# EAGLE design oled_array_v1 (EAGLE 7.6.0)
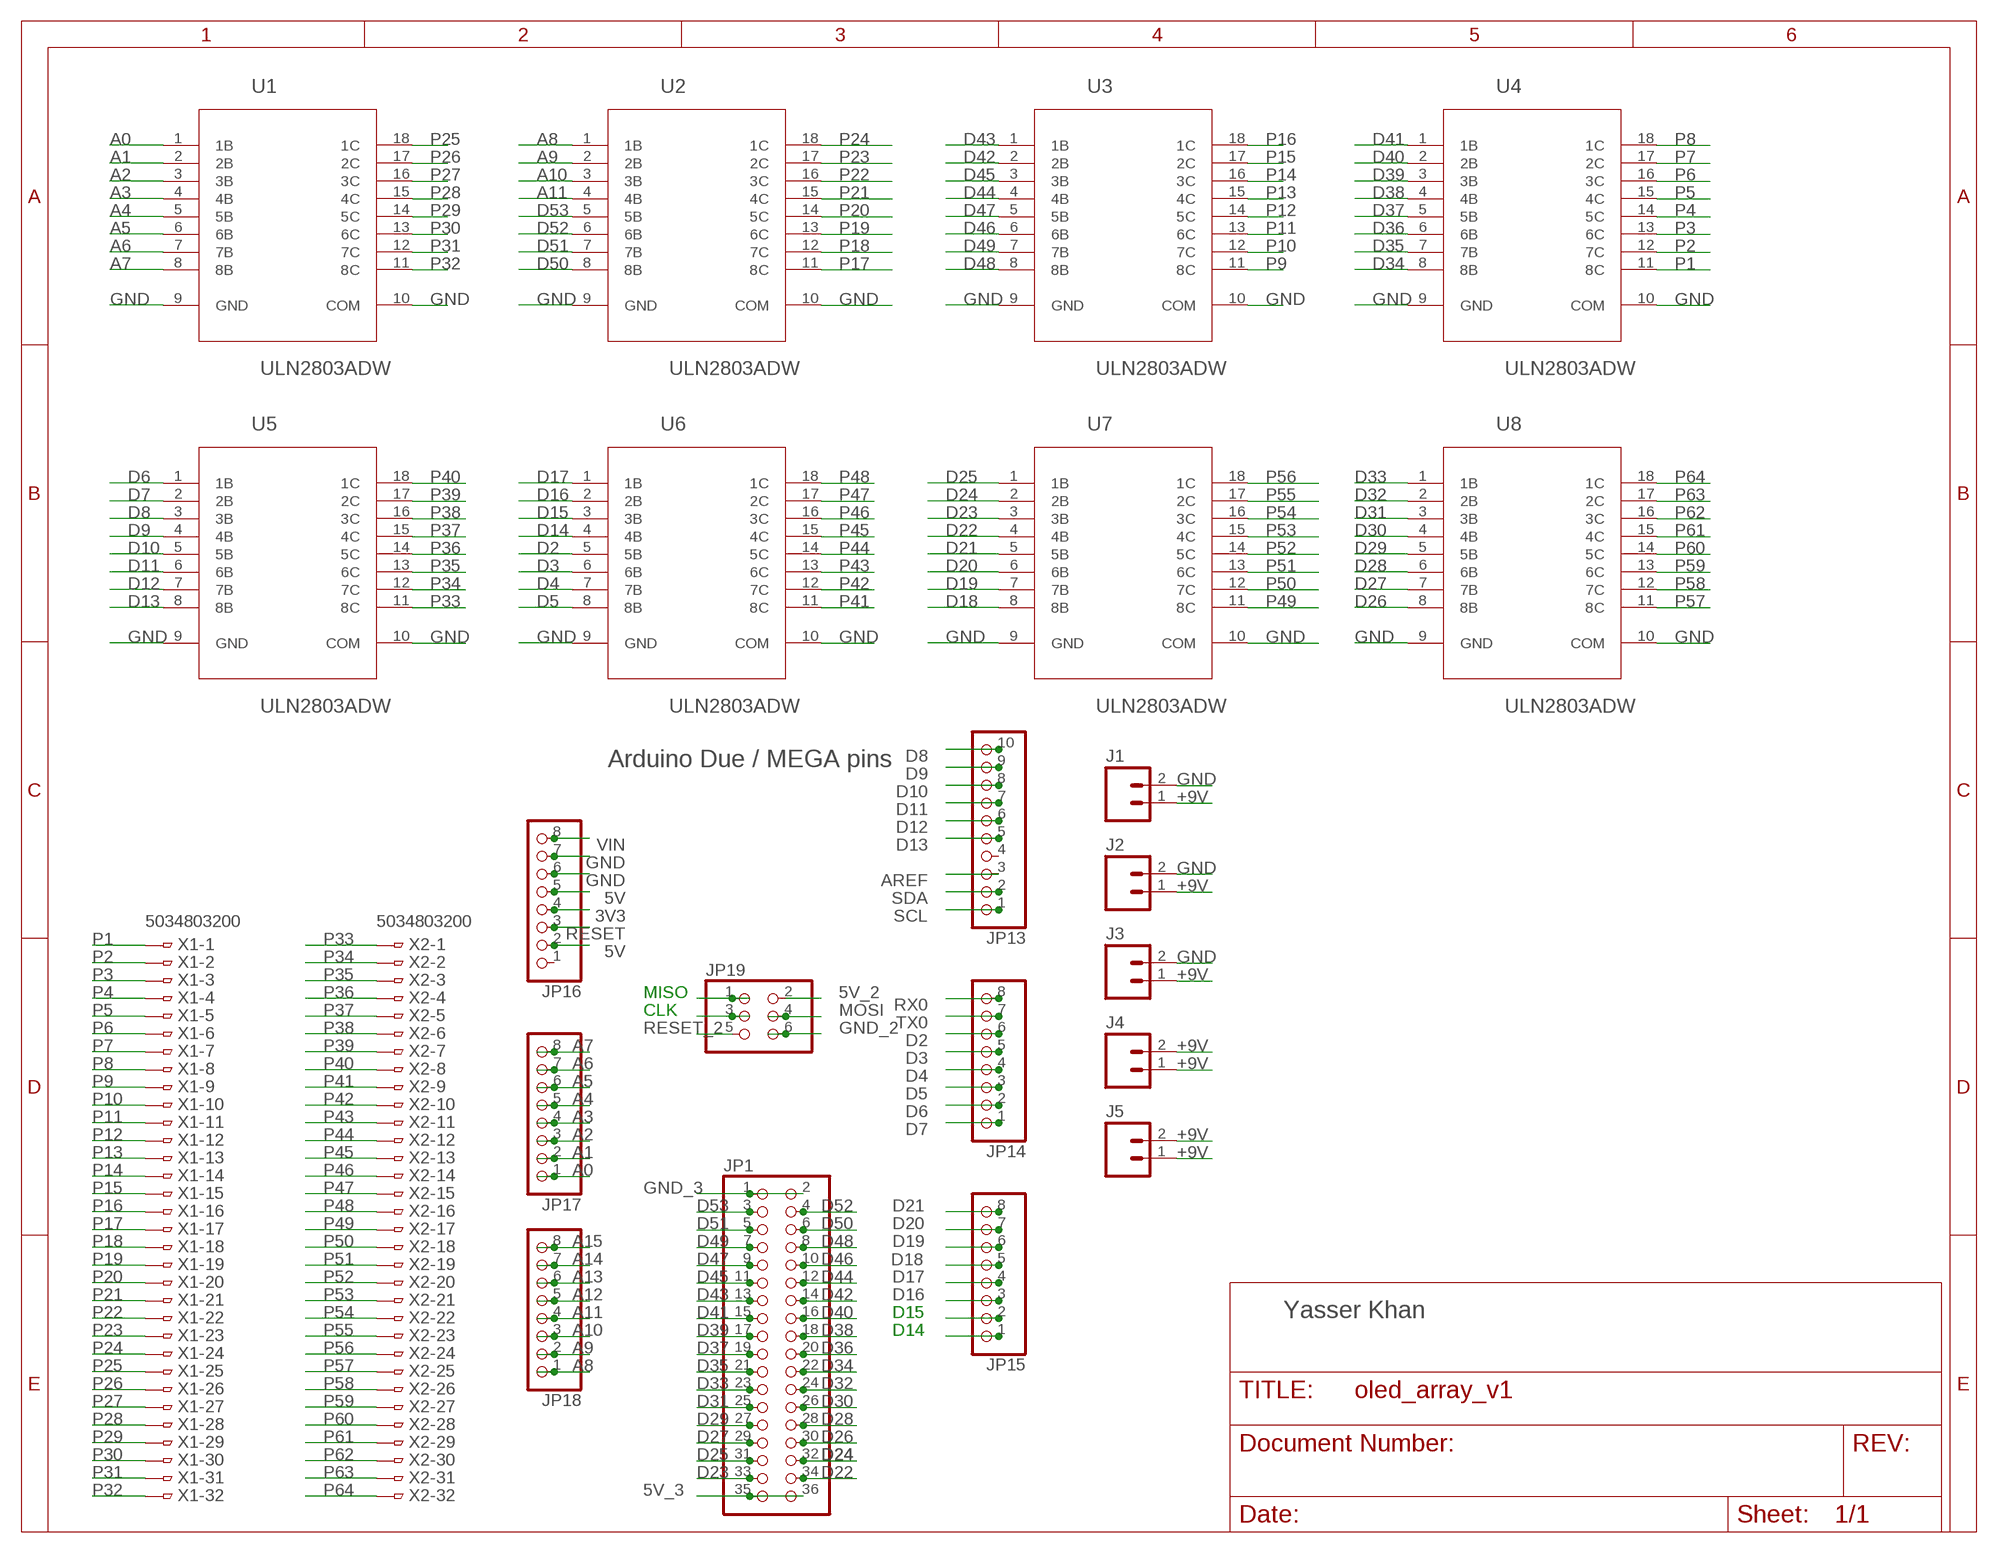
[diagram p0: schematic, sheet 1]

## Parts
J1  M02PTH  [1X02]
J2  M02PTH  [1X02]
J3  M02PTH  [1X02]
J4  M02PTH  [1X02]
J5  M02PTH  [1X02]
JP1  PINHD-2X18  [2X18]
JP13  PINHD-1X10  [1X10]
JP14  PINHD-1X8  [1X08]
JP15  PINHD-1X8  [1X08]
JP16  PINHD-1X8  [1X08]
JP17  PINHD-1X8  [1X08]
JP18  PINHD-1X8  [1X08]
JP19  PINHD-2X3  [2X03]
U1  ULN2803ADW  [SOIC127P1030X265-18N]
U2  ULN2803ADW  [SOIC127P1030X265-18N]
U3  ULN2803ADW  [SOIC127P1030X265-18N]
U4  ULN2803ADW  [SOIC127P1030X265-18N]
U5  ULN2803ADW  [SOIC127P1030X265-18N]
U6  ULN2803ADW  [SOIC127P1030X265-18N]
U7  ULN2803ADW  [SOIC127P1030X265-18N]
U8  ULN2803ADW  [SOIC127P1030X265-18N]
X1  5034803200  [5034803200]
X2  5034803200  [5034803200]

## Nets
3V3: JP16.4
5V: JP16.2 JP16.5
5V_2: JP19.2
5V_3: JP1.35 JP1.36
+9V: J1.1 J2.1 J3.1 J4.1 J4.2 J5.1 J5.2
A0: JP17.1 U1.1(1B)
A1: JP17.2 U1.2(2B)
A2: JP17.3 U1.3(3B)
A3: JP17.4 U1.4(4B)
A4: JP17.5 U1.5(5B)
A5: JP17.6 U1.6(6B)
A6: JP17.7 U1.7(7B)
A7: JP17.8 U1.8(8B)
A8: JP18.1 U2.1(1B)
A9: JP18.2 U2.2(2B)
A10: JP18.3 U2.3(3B)
A11: JP18.4 U2.4(4B)
A12: JP18.5
A13: JP18.6
A14: JP18.7
A15: JP18.8
AREF: JP13.3
CLK: JP19.3
D2: JP14.6 U6.5(5B)
D3: JP14.5 U6.6(6B)
D4: JP14.4 U6.7(7B)
D5: JP14.3 U6.8(8B)
D6: JP14.2 U5.1(1B)
D7: JP14.1 U5.2(2B)
D8: JP13.10 U5.3(3B)
D9: JP13.9 U5.4(4B)
D10: JP13.8 U5.5(5B)
D11: JP13.7 U5.6(6B)
D12: JP13.6 U5.7(7B)
D13: JP13.5 U5.8(8B)
D14: JP15.1 U6.4(4B)
D15: JP15.2 U6.3(3B)
D16: JP15.3 U6.2(2B)
D17: JP15.4 U6.1(1B)
D18: JP15.5 U7.8(8B)
D19: JP15.6 U7.7(7B)
D20: JP15.7 U7.6(6B)
D21: JP15.8 U7.5(5B)
D22: JP1.34 U7.4(4B)
D23: JP1.33 U7.3(3B)
D24: JP1.32 U7.2(2B)
D25: JP1.31 U7.1(1B)
D26: JP1.30 U8.8(8B)
D27: JP1.29 U8.7(7B)
D28: JP1.28 U8.6(6B)
D29: JP1.27 U8.5(5B)
D30: JP1.26 U8.4(4B)
D31: JP1.25 U8.3(3B)
D32: JP1.24 U8.2(2B)
D33: JP1.23 U8.1(1B)
D34: JP1.22 U4.8(8B)
D35: JP1.21 U4.7(7B)
D36: JP1.20 U4.6(6B)
D37: JP1.19 U4.5(5B)
D38: JP1.18 U4.4(4B)
D39: JP1.17 U4.3(3B)
D40: JP1.16 U4.2(2B)
D41: JP1.15 U4.1(1B)
D42: JP1.14 U3.2(2B)
D43: JP1.13 U3.1(1B)
D44: JP1.12 U3.4(4B)
D45: JP1.11 U3.3(3B)
D46: JP1.10 U3.6(6B)
D47: JP1.9 U3.5(5B)
D48: JP1.8 U3.8(8B)
D49: JP1.7 U3.7(7B)
D50: JP1.6 U2.8(8B)
D51: JP1.5 U2.7(7B)
D52: JP1.4 U2.6(6B)
D53: JP1.3 U2.5(5B)
GND: J1.2 J2.2 J3.2 JP16.6 JP16.7 U1.9(GND) U1.10(COM) U2.9(GND) U2.10(COM) U3.9(GND) U3.10(COM) U4.9(GND) U4.10(COM) U5.9(GND) U5.10(COM) U6.9(GND) U6.10(COM) U7.9(GND) U7.10(COM) U8.9(GND) U8.10(COM)
GND_2: JP19.6
GND_3: JP1.1 JP1.2
MISO: JP19.1
MOSI: JP19.4
P1: U4.11(8C) X1.1
P2: U4.12(7C) X1.2
P3: U4.13(6C) X1.3
P4: U4.14(5C) X1.4
P5: U4.15(4C) X1.5
P6: U4.16(3C) X1.6
P7: U4.17(2C) X1.7
P8: U4.18(1C) X1.8
P9: U3.11(8C) X1.9
P10: U3.12(7C) X1.10
P11: U3.13(6C) X1.11
P12: U3.14(5C) X1.12
P13: U3.15(4C) X1.13
P14: U3.16(3C) X1.14
P15: U3.17(2C) X1.15
P16: U3.18(1C) X1.16
P17: U2.11(8C) X1.17
P18: U2.12(7C) X1.18
P19: U2.13(6C) X1.19
P20: U2.14(5C) X1.20
P21: U2.15(4C) X1.21
P22: U2.16(3C) X1.22
P23: U2.17(2C) X1.23
P24: U2.18(1C) X1.24
P25: U1.18(1C) X1.25
P26: U1.17(2C) X1.26
P27: U1.16(3C) X1.27
P28: U1.15(4C) X1.28
P29: U1.14(5C) X1.29
P30: U1.13(6C) X1.30
P31: U1.12(7C) X1.31
P32: U1.11(8C) X1.32
P33: U5.11(8C) X2.1
P34: U5.12(7C) X2.2
P35: U5.13(6C) X2.3
P36: U5.14(5C) X2.4
P37: U5.15(4C) X2.5
P38: U5.16(3C) X2.6
P39: U5.17(2C) X2.7
P40: U5.18(1C) X2.8
P41: U6.11(8C) X2.9
P42: U6.12(7C) X2.10
P43: U6.13(6C) X2.11
P44: U6.14(5C) X2.12
P45: U6.15(4C) X2.13
P46: U6.16(3C) X2.14
P47: U6.17(2C) X2.15
P48: U6.18(1C) X2.16
P49: U7.11(8C) X2.17
P50: U7.12(7C) X2.18
P51: U7.13(6C) X2.19
P52: U7.14(5C) X2.20
P53: U7.15(4C) X2.21
P54: U7.16(3C) X2.22
P55: U7.17(2C) X2.23
P56: U7.18(1C) X2.24
P57: U8.11(8C) X2.25
P58: U8.12(7C) X2.26
P59: U8.13(6C) X2.27
P60: U8.14(5C) X2.28
P61: U8.15(4C) X2.29
P62: U8.16(3C) X2.30
P63: U8.17(2C) X2.31
P64: U8.18(1C) X2.32
RESET: JP16.3
RESET_2: JP19.5
RX0: JP14.8
SCL: JP13.1
SDA: JP13.2
TX0: JP14.7
VIN: JP16.8
Unconnected: JP13.4 JP16.1

## Notes on the sheet
- Arduino Due / MEGA pins
- Yasser Khan

## Library data of the parts
J1-J5 = SparkFun-Connectors:M02: Standard 2-pin 0.1" header. Use with - straight break away headers ( PRT-00116) - right angle break away headers (PRT-00553) - swiss pins (PRT-00743) - machine pins (PRT-00117) - female headers (PRT-00115) Molex polarized connector foot print use with: PRT-08233 with associated crimp pins and housings. 2.54_SCREWTERM for use with PRT-10571. 3.5mm Screw Terminal footprints for PRT-08084 5mm Screw Terminal footprints for use with PRT-08432
JP1 = pinhead:PINHD-2X18: PIN HEADER
JP13 = pinhead:PINHD-1X10: PIN HEADER
JP14-JP18 = pinhead:PINHD-1X8: PIN HEADER
JP19 = pinhead:PINHD-2X3: PIN HEADER
U1-U8 = ULN2803ADW:ULN2803ADW: Darlington transistor array; MPN: ULN2803ADW; OC_FARNELL: 1652419; OC_NEWARK: 69K0711; PACKAGE: SOIC-18; SUPPLIER: TEXAS INSTRUMENTS
X1 X2 = con-hirose:5034803200: 0.5mm Pitch Connectors For FPC/FFC Source: Data sheet <http://www.hirose.co.jp/cataloge_hp/e58605370.pdf>

## Net classes
1 vcc: width 0.305 mm

## Board
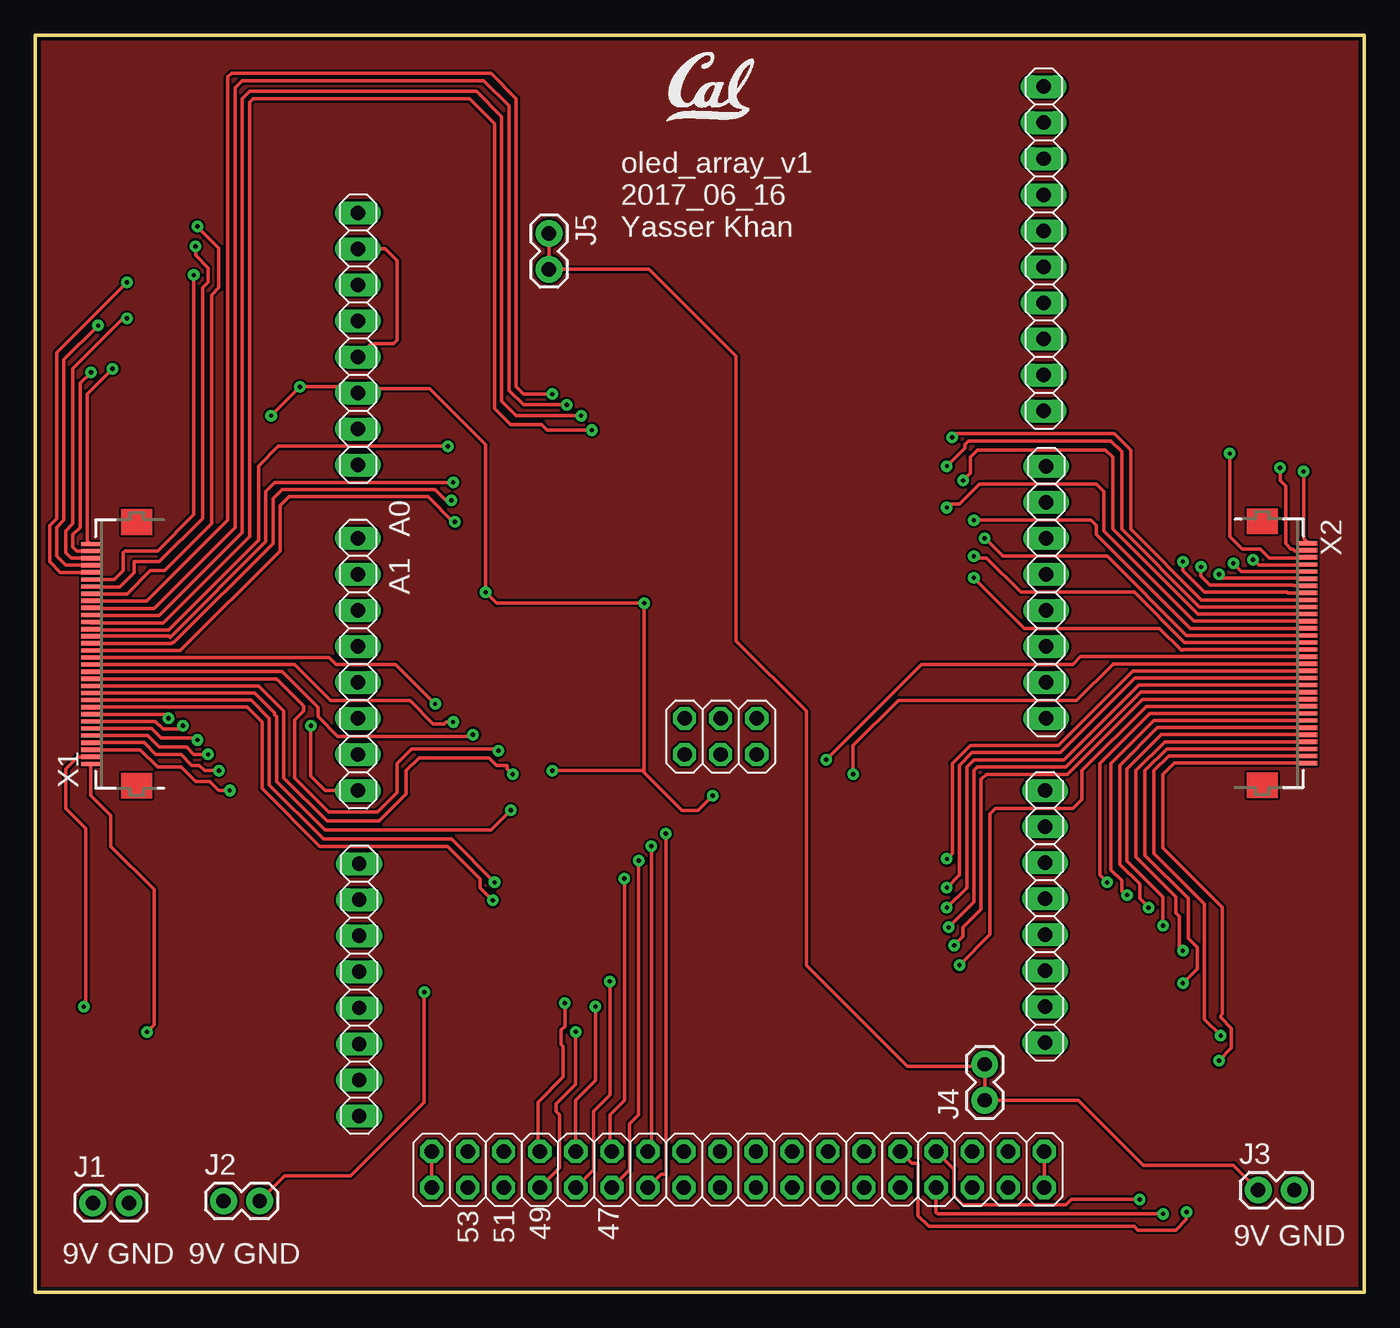
[diagram p1: board, top side]
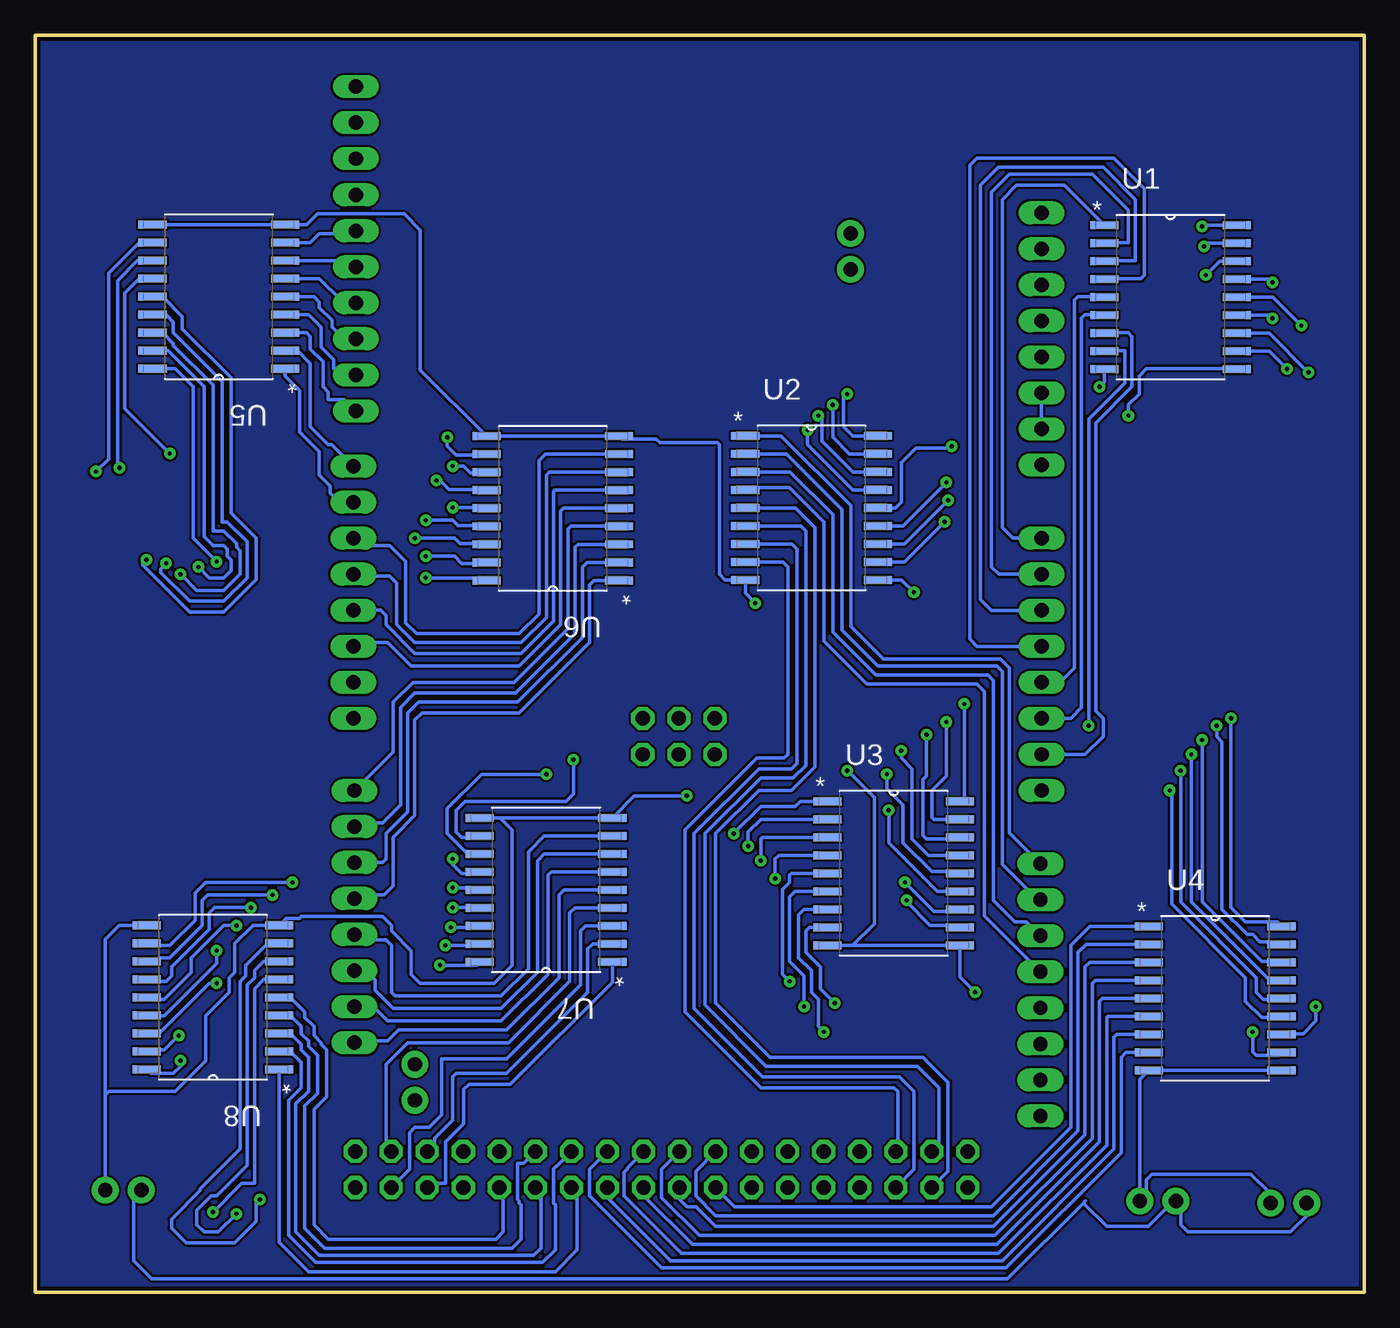
[diagram p2: board, bottom side, seen from below]

Size 93.64 x 88.57 mm. Coordinates in mm from the lower left corner, seen from the top.
Outline: 0,88.57 0,0 93.64,0 93.64,88.57 0,88.57
Copper layers (1*16): Top 0.035mm / dielectric 1.5mm / Bottom 0.035mm
Design rules "2016_09_11_SparkFun_bayareacircuits": minimum track width 8mil, minimum drill 10mil, track to track 6mil, track to pad 6mil, pad to pad 6mil, via to via 6mil, smd to smd 6mil, copper to edge 10mil, drill to drill 8mil, minimum pad ring 12mil, minimum via ring 10mil, stop-mask expansion 4mil, vias tented up to drill 25mil, thermal gap 10mil

### Footprints (pad centres in the part's own frame; a part is rotated, then mirrored left to right if it is on the bottom)
1X02 = drill 1.016 pad 1.88: 1 0,0; 2 2.54,0
2X18 = drill 1.016 octagon: 1 -21.59,-1.27; 2 -21.59,1.27; 3 -19.05,-1.27; 4 -19.05,1.27; 5 -16.51,-1.27; 6 -16.51,1.27; 7 -13.97,-1.27; 8 -13.97,1.27; 9 -11.43,-1.27; 10 -11.43,1.27; 11 -8.89,-1.27; 12 -8.89,1.27; 13 -6.35,-1.27; 14 -6.35,1.27; 15 -3.81,-1.27; 16 -3.81,1.27; 17 -1.27,-1.27; 18 -1.27,1.27; 19 1.27,-1.27; 20 1.27,1.27; 21 3.81,-1.27; 22 3.81,1.27; 23 6.35,-1.27; 24 6.35,1.27; 25 8.89,-1.27; 26 8.89,1.27; 27 11.43,-1.27; 28 11.43,1.27; 29 13.97,-1.27; 30 13.97,1.27; 31 16.51,-1.27; 32 16.51,1.27; 33 19.05,-1.27; 34 19.05,1.27; 35 21.59,-1.27; 36 21.59,1.27
1X10 = drill 1.016 long: 1 -11.43,0; 2 -8.89,0; 3 -6.35,0; 4 -3.81,0; 5 -1.27,0; 6 1.27,0; 7 3.81,0; 8 6.35,0; 9 8.89,0; 10 11.43,0
1X08 = drill 1.016 long: 1 -8.89,0; 2 -6.35,0; 3 -3.81,0; 4 -1.27,0; 5 1.27,0; 6 3.81,0; 7 6.35,0; 8 8.89,0
2X03 = drill 1.016 octagon: 1 -2.54,-1.27; 2 -2.54,1.27; 3 0,-1.27; 4 0,1.27; 5 2.54,-1.27; 6 2.54,1.27
SOIC127P1030X265-18N = smd 1.981 x 0.559: 1 -4.674,5.08; 2 -4.674,3.81; 3 -4.674,2.54; 4 -4.674,1.27; 5 -4.674,0; 6 -4.674,-1.27; 7 -4.674,-2.54; 8 -4.674,-3.81; 9 -4.674,-5.08; 10 4.674,-5.08; 11 4.674,-3.81; 12 4.674,-2.54; 13 4.674,-1.27; 14 4.674,0; 15 4.674,1.27; 16 4.674,2.54; 17 4.674,3.81; 18 4.674,5.08
5034803200 = smd 0.3 x 1.3: 1 -7.75,3.25; 2 -7.25,3.25; 3 -6.75,3.25; 4 -6.25,3.25; 5 -5.75,3.25; 6 -5.25,3.25; 7 -4.75,3.25; 8 -4.25,3.25; 9 -3.75,3.25; 10 -3.25,3.25; 11 -2.75,3.25; 12 -2.25,3.25; 13 -1.75,3.25; 14 -1.25,3.25; 15 -0.75,3.25; 16 -0.25,3.25; 17 0.25,3.25; 18 0.75,3.25; 19 1.25,3.25; 20 1.75,3.25; 21 2.25,3.25; 22 2.75,3.25; 23 3.25,3.25; 24 3.75,3.25; 25 4.25,3.25; 26 4.75,3.25; 27 5.25,3.25; 28 5.75,3.25; 29 6.25,3.25; 30 6.75,3.25; 31 7.25,3.25; 32 7.75,3.25

### Placement (x,y rotation side)
J1  4.04,6.27 0 top
J2  13.26,6.43 0 top
J3  86.18,7.19 0 top
J4  66.9,13.51 90 top
J5  36.2,74.63 270 top
JP1  49.51,8.64 0 top
JP13  71.07,73.54 270 top
JP14  71.24,49.32 270 top
JP15  71.15,26.47 270 top
JP16  22.73,67.19 270 top
JP17  22.73,44.24 270 top
JP18  22.81,21.3 270 top
JP19  48.3,39.16 0 top
U1  13.64,70.13 0 bottom
U2  38.94,55.27 0 bottom
U3  33.15,29.51 0 bottom
U4  10.49,20.7 0 bottom
U5  80.72,70.16 180 bottom
U6  57.18,55.25 180 bottom
U7  57.66,28.35 180 bottom
U8  81.13,20.78 180 bottom
X1  7.14,44.98 90 top
X2  86.46,45.03 270 top

### Tracks (layer width: path | path; a pad name or v marks a point on that pad's centre or on a via)
5V
  Top 0.254: JP16.2 24.66,73.54 25.5,72.7 25.5,67.11 25.25,66.85 23.67,66.85 JP16.5
5V_3
  Top 0.254: JP1.36 JP1.35
+9V
  Top 0.254: J3.1 84.43,8.94 78.08,8.94 73.51,13.51 J4.1 J4.2 66.78,15.93 61.44,15.93 54.33,23.04 54.33,40.95 49.38,45.9 49.38,65.96 43.26,72.09 J5.2 J5.1
  Bottom 0.254: J1.1 4.04,5.38 5.18,4.24 12.42,4.24 12.93,4.75 12.93,6.1 J2.1 13.41,6.43 15.21,4.62 18.14,4.62 19.79,6.27 | 19.63,6.43 19.79,6.27 | 19.79,6.27 25.12,0.94 85.45,0.94 86.72,2.21 86.72,6.66 J3.1
A0
  Bottom 0.254: U1.1 21.13,78.03 24.49,78.03 25.5,77.01 25.5,53.9 24.74,53.13 JP17.1
A1
  Bottom 0.254: U1.2 18.29,73.97 16.61,73.97 16.61,76.25 19.15,78.79 24.99,78.79 26.26,77.52 26.26,51.11 25.75,50.59 JP17.2
A2
  Bottom 0.254: U1.3 18.29,72.7 16.1,72.7 16.1,77.01 18.39,79.3 25.76,79.3 27.03,78.03 27.03,48.82 26.26,48.05 JP17.3
A3
  Bottom 0.254: U1.4 18.29,71.42 15.72,71.42 15.47,71.68 15.47,77.78 17.63,79.93 27.28,79.93 27.79,79.43 27.79,46.02 27.28,45.51 JP17.4
A4
  Bottom 0.254: U1.5 18.34,70.16 20.17,70.16 20.42,69.9 20.42,43.99 21.44,42.97 JP17.5
A5
  Bottom 0.254: U1.6 18.34,68.89 19.66,68.89 19.91,68.63 19.91,41.2 20.68,40.43 JP17.6
A6
  Bottom 0.254: U1.7 18.29,67.61 16.61,67.61 16.36,67.36 16.36,63.8 18.9,61.27 18.9,40.95 18.39,40.44 18.39,39.17 19.66,37.89 JP17.7
A7  (via drill 0.3)
  Top 0.254: v19.41,39.93 19.41,36.37 20.42,35.35 JP17.8
  Bottom 0.254: U1.8 18.29,66.34 16.87,66.34 16.87,64.06 19.41,61.52 v19.41,39.93
A8
  Bottom 0.254: JP18.1 24.99,32.37 24.99,43.99 25.63,44.63 33.88,44.63 36.17,46.91 36.17,55.42 41.1,60.35 U2.1
A9
  Bottom 0.254: JP18.2 22.83,27.63 22.83,27.48 25.5,30.15 25.5,43.74 25.88,44.12 34.26,44.12 36.8,46.66 36.8,55.17 40.72,59.08 U2.2
A10
  Bottom 0.254: JP18.3 23.79,26.09 24.61,26.09 26.14,27.61 26.14,43.1 26.52,43.48 34.39,43.48 37.44,46.53 37.44,54.79 40.46,57.81 U2.3
A11
  Bottom 0.254: JP18.4 26.77,26.53 26.77,42.34 27.28,42.85 35.03,42.85 38.07,45.9 38.07,54.28 40.49,56.69 43.03,56.69 43.18,56.54 U2.4
D2
  Bottom 0.254: U6.5 56.41,55.25 56.62,55.04 56.62,47.04 59.54,44.12 67.16,44.12 68.81,45.77 70.98,45.77 JP14.6
D3
  Bottom 0.254: U6.6 57.05,56.52 57.12,56.44 57.12,47.3 59.41,45.01 66.9,45.01 68.94,47.04 68.94,47.68 69.32,48.06 JP14.5
D4
  Bottom 0.254: U6.7 57.43,57.79 57.63,57.58 57.63,47.55 59.41,45.77 66.9,45.77 68.17,47.04 68.17,49.96 68.68,50.47 71.12,50.47 JP14.4
D5
  Bottom 0.254: U6.8 57.68,59.05 58.14,58.6 58.14,47.8 59.54,46.41 66.78,46.41 67.54,47.17 67.54,51.49 68.68,52.63 70.73,52.63 JP14.3
D6
  Bottom 0.254: U5.1 76.05,64.57 75.03,63.55 75.03,60.63 73.63,59.23 73.63,57.58 72.87,56.82 72.87,56.31 72.36,55.8 71.37,55.8 JP14.2
D7
  Bottom 0.254: U5.2 75.16,66.34 74.27,65.46 74.27,61.01 73,59.74 72.77,59.74 JP14.1
D8
  Bottom 0.254: U5.3 74.52,67.61 74.27,67.36 74.27,66.47 73.38,65.58 73.38,63.8 73,63.42 73,62.92 71.88,62.92 JP13.10
D9
  Bottom 0.254: U5.4 74.4,68.89 73.51,68 73.51,66.6 72.62,65.71 72.62,65.08 71.5,65.08 JP13.9
D10
  Bottom 0.254: U5.5 74.02,70.16 73.63,69.77 73.63,69.39 72.75,68.5 72.75,68 72.11,67.36 71.24,67.36 JP13.8
D11
  Bottom 0.254: U5.6 73.63,71.42 72.11,69.9 71.24,69.9 JP13.7
D12
  Bottom 0.254: U5.7 71.5,72.7 JP13.6
D13
  Bottom 0.254: U5.8 74.27,73.97 73.63,74.6 71.27,74.6 JP13.5
D14
  Bottom 0.254: U6.4 55.91,53.98 56.11,53.77 56.11,46.79 59.92,42.98 67.03,42.98 68.43,41.58 68.43,38.08 JP15.1
D15
  Bottom 0.254: U6.3 55.4,52.71 55.6,52.5 55.6,46.41 59.79,42.22 66.9,42.22 67.92,41.2 67.92,34.34 69.19,33.07 70.9,33.07 JP15.2
D16
  Bottom 0.254: U6.2 54.76,51.44 55.09,51.11 55.09,46.15 59.66,41.58 66.65,41.58 67.41,40.82 67.41,33.83 68.94,32.31 68.94,30.53 69.19,30.28 JP15.3
D17
  Bottom 0.254: U6.1 54.25,50.16 54.58,49.84 54.58,45.77 59.54,40.82 66.4,40.82 66.9,40.31 66.9,33.58 68.43,32.05 68.43,28.63 69.06,27.99 70.9,27.99 JP15.4
D18
  Bottom 0.254: U7.8 57.78,32.16 58.9,31.04 58.9,22.78 60.81,20.88 68.3,20.88 68.55,21.13 68.55,24.43 68.94,24.82 70.77,24.82 JP15.5
D19
  Bottom 0.254: U7.7 57.78,30.89 58.27,30.4 58.27,22.53 60.81,19.99 68.43,19.99 69.7,21.26 69.7,22.02 69.95,22.28 70.77,22.28 JP15.6
D20
  Bottom 0.254: U7.6 57.28,29.62 57.51,29.39 57.51,22.4 60.81,19.1 68.81,19.1 69.7,19.99 71.03,19.99 JP15.7
D21
  Bottom 0.254: U7.5 56.39,28.35 56.74,27.99 56.74,22.15 60.43,18.47 68.05,18.47 68.81,17.7 71.03,17.7 JP15.8
D22
  Bottom 0.254: U7.4 55.63,27.08 55.98,26.72 55.98,21.89 60.3,17.58 67.41,17.58 68.94,16.05 68.94,10.28 JP1.34
D23
  Bottom 0.254: U7.3 54.86,25.81 55.22,25.45 55.22,21.64 60.43,16.43 65,16.43 65,12.5 65.89,11.61 66.9,11.61 67.28,11.23 67.28,8.65 JP1.33
D24
  Bottom 0.254: U7.2 54.36,24.54 54.71,24.18 54.71,21.13 60.43,15.42 63.98,15.42 64.24,15.16 64.24,12.12 65.51,10.85 65.51,10.42 JP1.32
D25
  Bottom 0.254: U7.1 52.98,21.84 60.17,14.66 63.09,14.66 63.47,14.28 63.47,11.86 64.74,10.59 64.74,7.67 65.72,7.67 JP1.31
D26  (via drill 0.3)
  Top 0.254: v77.83,6.53 73,6.53 72.62,6.15 65.38,6.15 64.74,6.78 64.74,8.65 JP1.30
  Bottom 0.254: U8.8 77.29,24.59 78.84,23.04 78.84,22.28 79.22,21.89 79.22,10.08 82.02,7.29 82.02,7.16 84.05,5.13 84.05,4.5 83.03,3.48 79.6,3.48 78.08,5 78.08,6.27 v77.83,6.53
D27  (via drill 0.3)
  Top 0.254: v79.48,5.51 63.6,5.51 63.47,5.64 63.47,7.36 JP1.29
  Bottom 0.254: U8.7 77.55,23.32 78.21,22.66 78.21,22.15 78.71,21.64 78.71,8.94 80.87,6.78 81.25,6.78 82.27,5.77 82.27,4.75 81.76,4.24 80.75,4.24 v79.48,5.51
D28  (via drill 0.3)
  Top 0.254: JP1.28 61.78,9.07 62.2,9.07 62.2,5.38 62.97,4.62 77.44,4.62 77.7,4.37 80.37,4.37 81.13,5.13 v81.13,5.64
  Bottom 0.254: U8.6 77.55,22.05 78.21,21.39 78.21,7.67 79.1,7.67 v81.13,5.64
D29
  Bottom 0.254: U8.5 75.69,20.78 74.65,19.74 74.65,19.35 74.02,18.72 74.02,18.08 73.51,17.58 73.51,17.45 73.13,17.07 73.13,13.77 74.02,12.88 74.02,4.75 73,3.73 61.19,3.73 60.68,4.24 60.68,7.1 JP1.27
D30
  Bottom 0.254: U8.4 75.69,19.51 74.9,18.72 74.9,18.21 74.4,17.7 74.4,17.32 73.76,16.69 73.76,14.02 74.65,13.13 74.65,4.5 73.25,3.1 60.05,3.1 59.41,3.73 59.41,6.15 59.54,6.27 59.54,6.4 59.66,6.53 59.66,9.07 59.24,9.07 JP1.26
D31
  Bottom 0.254: U8.3 75.69,18.24 74.9,17.45 74.9,17.07 74.4,16.56 74.4,14.15 75.29,13.26 75.29,4.24 73.63,2.59 58.52,2.59 58.01,3.1 58.01,6.98 JP1.25
D32
  Bottom 0.254: U8.2 75.69,16.97 74.9,16.18 74.9,14.4 75.79,13.51 75.79,3.99 73.89,2.08 57.89,2.08 57,2.97 57,6.15 57.12,6.27 57.12,8.69 57,8.81 56.96,8.81 JP1.24
D33
  Bottom 0.254: U8.1 76.45,3.51 74.4,1.45 57,1.45 55.47,2.97 55.47,6.98 JP1.23
D34
  Bottom 0.254: U4.8 16.79,16.89 17.12,16.56 17.12,9.83 25.25,1.7 49.5,1.7 54.58,6.78 54.58,8.65 JP1.22
D35
  Bottom 0.254: U4.7 17.42,18.16 17.63,17.96 17.63,10.08 25.5,2.21 48.87,2.21 53.31,6.66 53.31,7.36 JP1.21
D36
  Bottom 0.254: U4.6 18.06,19.43 18.14,19.35 18.14,10.34 25.76,2.72 48.11,2.72 52.17,6.78 52.17,8.43 51.92,8.69 51.92,8.77 JP1.20
D37
  Bottom 0.254: U4.5 18.44,20.7 18.64,20.5 18.64,10.59 25.88,3.35 47.35,3.35 50.77,6.78 50.77,7.36 JP1.19
D38
  Bottom 0.254: U4.4 18.95,21.97 19.15,21.77 19.15,10.85 26.01,3.99 46.84,3.99 49.5,6.66 49.5,8.65 JP1.18
D39
  Bottom 0.254: U4.3 19.33,23.24 19.66,22.91 19.66,11.1 26.14,4.62 45.69,4.62 47.09,6.02 47.73,6.02 48.36,6.66 48.36,7.25 JP1.17
D40
  Bottom 0.254: U4.2 19.58,24.51 20.17,23.93 20.17,11.35 26.14,5.38 45.69,5.38 47.09,6.78 47.09,8.52 JP1.16
D41
  Bottom 0.254: U4.1 19.33,25.78 20.68,24.43 20.68,11.61 26.26,6.02 44.36,6.02 JP1.15
D42  (via drill 0.3)
  Top 0.254: v43.41,31.42 43.41,10.15 JP1.14
  Bottom 0.254: U3.2 42.52,33.33 43.41,32.44 v43.41,31.42
D43  (via drill 0.3)
  Top 0.254: v44.42,32.31 44.42,8.31 44.1,8.31 JP1.13
  Bottom 0.254: U3.1 39.73,34.59 40.11,34.21 42.52,34.21 v44.42,32.31
D44  (via drill 0.3)
  Top 0.254: v41.5,29.13 41.5,13.51 40.49,12.5 40.49,10.04 JP1.12
  Bottom 0.254: U3.4 41.25,30.79 41.5,30.53 v41.5,29.13
D45  (via drill 0.3)
  Top 0.254: v42.52,30.4 42.52,12.5 41.88,11.86 41.88,8.63 JP1.11
  Bottom 0.254: U3.3 42.39,32.05 42.52,31.93 v42.52,30.4
D46  (via drill 0.3)
  Top 0.254: v39.47,20.12 39.47,14.91 38.07,13.51 38.07,9.92 JP1.10
  Bottom 0.254: U3.6 40.11,28.24 40.49,27.86 40.49,23.29 39.47,22.28 v39.47,20.12
D47  (via drill 0.3)
  Top 0.254: v40.49,21.89 40.49,13.89 39.34,12.75 39.34,8.63 JP1.9
  Bottom 0.254: U3.5 40.36,29.51 40.49,29.39 40.49,28.88 41,28.37 41,22.4 v40.49,21.89
D48  (via drill 0.3)
  Top 0.254: v37.31,20.37 37.31,18.72 37.06,18.47 37.06,17.45 37.19,17.32 37.19,15.16 35.41,13.39 35.41,10.04 JP1.8
  Bottom 0.254: U3.8 39.09,25.7 39.34,25.45 39.34,23.93 38.33,22.91 38.33,21.39 v37.31,20.37
D49  (via drill 0.3)
  Top 0.254: v38.07,18.34 38.07,14.66 36.68,13.26 36.68,12.75 36.93,12.5 36.93,8.75 JP1.7
  Bottom 0.254: U3.7 39.47,26.97 39.85,26.59 39.85,23.55 38.96,22.66 38.96,21.13 38.46,20.62 38.46,18.72 v38.07,18.34
D50
  Bottom 0.254: U2.8 40.97,51.46 40.61,51.11 40.61,37.9 40.87,37.64 42.77,37.64 47.85,32.56 47.85,19.74 42.52,14.4 33.12,14.4 32.87,14.15 32.87,10.04 JP1.6
D51
  Bottom 0.254: U2.7 40.34,52.73 39.98,52.38 39.98,37.26 40.36,36.88 42.65,36.88 47.22,32.31 47.22,19.99 42.39,15.16 32.74,15.16 31.72,14.15 31.72,8.65 JP1.5
D52
  Bottom 0.254: U2.6 39.7,54 39.34,53.65 39.34,37.14 40.23,36.25 42.52,36.25 46.46,32.31 46.46,20.24 42.14,15.93 31.47,15.93 29.95,14.4 29.95,10.42 JP1.4
D53
  Bottom 0.254: U2.5 40.08,55.27 38.71,53.9 38.71,37.01 40.36,35.36 42.65,35.36 45.69,32.31 45.69,20.37 41.88,16.56 31.09,16.56 29.31,14.78 29.31,8.52 JP1.3
GND  (via drill 0.3)
  Top 0.254: v16.61,61.77 v18.64,63.8 22.3,63.8 JP16.6 23.03,63.68 27.79,63.68 31.72,59.74 v31.72,49.33 32.49,48.57 v42.9,48.57 42.9,36.63 | v36.42,36.75 42.77,36.75 42.9,36.63 | 42.9,36.63 45.57,33.96 46.71,33.96 v47.73,34.98 | v27.41,21.13 27.41,13.39 22.2,8.18 17.55,8.18 J2.2
  Bottom 0.254: JP16.7 JP16.6 | U1.10 8.99,65.08 15.34,65.08 15.85,64.57 15.85,63.3 16.61,62.54 v16.61,61.77 | v18.64,63.8 18.31,64.14 U1.9 | U2.10 32.59,50.19 v31.72,49.33 | v42.9,48.57 43.61,49.28 U2.9 45.03,50.19 45.44,50.6 45.44,59.74 45.57,59.87 49.63,59.87 49.89,60.12 52.3,60.12 U6.9 U6.10 66.52,65 66.52,74.85 67.67,76 73.76,76 74.52,75.23 U5.9 U5.10 | v36.42,36.75 34.52,34.85 34.52,25.96 36.04,24.43 U3.9 U3.10 28.47,22.2 v27.41,21.13 | v47.73,34.98 51.43,34.98 U7.9 U7.10 60.91,33.43 60.05,32.56 60.05,23.04 61.32,21.77 66.52,21.77 67.16,22.4 67.16,24.05 68.55,25.45 68.55,25.83 69.19,26.47 74.9,26.47 75.03,26.34 75.97,26.34 U8.9 78.31,25.86 79.6,24.56 79.6,22.53 79.98,22.15 79.98,21.13 81.64,19.48 81.64,16.31 83.79,14.15 88.47,14.15 88.72,13.89 | J1.2 6.58,6.91 7.98,8.31 14.96,8.31 15.34,7.92 15.34,6.88 J2.2 15.8,14.99 U4.9 U4.10 | J3.2 88.72,13.89 | 88.72,13.89 88.72,24.84 87.73,25.83 85.83,25.83 U8.10
GND_3
  Top 0.254: JP1.2 JP1.1
N$1
  pour Bottom: 93.73,88.57 93.73,-0.08 0,-0.08 0,88.57
N$2
  pour Top: 93.73,88.57 93.73,-0.08 0,-0.08 0,88.57
P1  (via drill 0.3)
  Top 0.254: X1.1 3.89,35 5.31,33.58 5.31,31.42 8.36,28.37 8.36,18.85 v7.85,18.34
  Bottom 0.254: v7.85,18.34 7.85,16.94 7.59,16.69 6.02,16.69 U4.11
P2  (via drill 0.3)
  Top 0.254: X1.2 2.98,37.73 2.13,36.88 2.13,34.09 3.53,32.69 3.53,20.24 v3.4,20.12
  Bottom 0.254: v3.4,20.12 3.4,19.1 4.29,18.21 5.77,18.21 U4.12
P3  (via drill 0.3)
  Top 0.254: X1.3 7.39,38.23 8.61,37.01 10.26,37.01 11.28,35.99 12.29,35.99 12.93,35.36 v13.69,35.36
  Bottom 0.254: U4.13 5.89,19.35 7.21,19.35 8.36,20.5 8.36,22.15 13.56,27.36 13.56,35.23 v13.69,35.36
P4  (via drill 0.3)
  Top 0.254: X1.4 7.66,38.73 8.48,37.9 10.26,37.9 11.02,37.14 11.53,37.14 11.91,36.75 v12.93,36.75
  Bottom 0.254: v12.93,36.75 12.93,27.48 7.59,22.15 7.59,21.13 7.09,20.62 5.89,20.62 U4.14
P5  (via drill 0.3)
  Top 0.254: X1.5 7.92,39.23 8.74,38.41 10.64,38.41 11.15,37.9 v12.17,37.9
  Bottom 0.254: v12.17,37.9 12.17,27.48 6.58,21.89 5.89,21.89 U4.15
P6  (via drill 0.3)
  Top 0.254: X1.6 8.18,39.73 8.86,39.04 11.28,39.04 v11.4,38.91
  Bottom 0.254: v11.4,38.91 11.4,27.48 7.21,23.29 5.87,23.29 U4.16
P7  (via drill 0.3)
  Top 0.254: X1.7 8.44,40.23 8.99,39.68 10.13,39.68 v10.39,39.93
  Bottom 0.254: v10.39,39.93 10.39,39.17 10.01,38.79 10.01,26.97 8.23,25.2 7.85,25.2 7.34,24.69 5.99,24.69 U4.17
P8  (via drill 0.3)
  Top 0.254: X1.8 9.21,40.73 v9.37,40.44
  Bottom 0.254: v9.37,40.44 9.37,27.1 8.36,26.09 6.12,26.09 U4.18
P9  (via drill 0.3)
  Top 0.254: X1.9 14.93,41.23 15.98,40.18 15.98,35.48 20.04,31.42 29.06,31.42 31.34,29.13 31.34,28.5 v32.23,27.61
  Bottom 0.254: v32.23,27.61 32.23,27.48 30.58,25.83 28.6,25.83 U3.11
P10  (via drill 0.3)
  Top 0.254: X1.10 15.2,41.73 16.48,40.44 16.48,35.74 20.29,31.93 29.31,31.93 v32.36,28.88
  Bottom 0.254: v32.36,28.88 30.33,26.85 28.6,26.85 U3.12
P11  (via drill 0.3)
  Top 0.254: X1.11 15.46,42.23 16.87,40.82 16.87,40.69 16.99,40.56 16.99,35.99 20.42,32.56 32.11,32.56 v33.5,33.96
  Bottom 0.254: v33.5,33.96 33.5,31.67 30.07,28.24 U3.13
P12  (via drill 0.3)
  Top 0.254: X1.12 15.72,42.73 17.5,40.95 17.5,36.25 20.55,33.2 24.23,33.2 26.14,35.1 26.14,36.75 27.03,37.64 31.98,37.64 32.49,37.14 33.25,37.14 33.25,36.88 v33.63,36.5
  Bottom 0.254: v33.63,36.5 33.63,35.48 32.49,34.34 32.49,31.67 30.45,29.64 28.6,29.64 U3.14
P13  (via drill 0.3)
  Top 0.254: X1.13 17,43.23 18.9,41.33 18.9,40.95 18.26,40.31 18.26,36.25 20.68,33.83 24.1,33.83 25.5,35.23 25.5,37.26 26.52,38.28 32.49,38.28 v32.61,38.15
  Bottom 0.254: v32.61,38.15 32.61,37.64 31.85,36.88 31.85,31.93 30.71,30.79 U3.15
P14  (via drill 0.3)
  Top 0.254: X1.14 17.39,43.73 19.91,41.2 19.91,40.56 21.31,39.17 30.71,39.17 v30.84,39.29
  Bottom 0.254: v30.84,39.29 30.84,36.37 31.09,36.12 31.09,32.18 30.84,31.93 28.6,31.93 U3.16
P15  (via drill 0.3)
  Top 0.254: X1.15 18.28,44.23 20.8,41.71 26.39,41.71 28.04,40.06 28.8,40.06 28.93,40.18 v29.44,40.18
  Bottom 0.254: v29.44,40.18 29.44,36.37 30.45,35.36 30.45,33.45 30.33,33.33 U3.17
P16  (via drill 0.3)
  Top 0.254: X1.16 20.71,44.73 21.18,44.25 25.37,44.25 v28.17,41.45
  Bottom 0.254: v28.17,41.45 28.17,34.9 U3.18
P17  (via drill 0.3)
  Top 0.254: X1.17 3.9,45.21 10.21,45.21 17.25,52.25 17.25,55.42 17.88,56.06 27.66,56.06 29.44,54.28 v29.57,54.28
  Bottom 0.254: v29.57,54.28 32.38,51.46 U2.11
P18  (via drill 0.3)
  Top 0.254: X1.18 9.6,45.72 9.65,45.77 9.75,45.77 16.74,52.76 16.74,55.93 17.37,56.57 28.17,56.57 28.93,55.8 v29.31,55.8
  Bottom 0.254: v29.31,55.8 32.38,52.73 U2.12
P19  (via drill 0.3)
  Top 0.254: v29.44,57.07 16.87,57.07 16.23,56.44 16.23,52.88 9.5,46.15 9.42,46.23 4.78,46.23 4.77,46.23 X1.19
  Bottom 0.254: v29.44,57.07 32.51,54 U2.13
P20  (via drill 0.3)
  Top 0.254: X1.20 3.95,46.66 9.37,46.66 15.72,53.01 15.72,58.22 17.12,59.61 v29.06,59.61
  Bottom 0.254: v29.06,59.61 29.18,59.49 31.6,59.49 32.61,58.47 32.61,55.68 33.02,55.27 U2.14
P21  (via drill 0.3)
  Top 0.254: X1.21 3.95,47.17 8.99,47.17 15.09,53.26 15.09,83.87 15.34,84.12 30.58,84.12 32.36,82.35 32.36,62.28 33.5,61.14 35.66,61.14 36.04,60.76 v39.22,60.76
  Bottom 0.254: v39.22,60.76 39.22,59.74 36.02,56.54 U2.15
P22  (via drill 0.3)
  Top 0.254: X1.22 3.94,47.68 8.74,47.68 14.58,53.52 14.58,84.12 15.09,84.63 31.09,84.63 32.87,82.86 32.87,62.79 33.88,61.77 v38.46,61.77
  Bottom 0.254: v38.46,61.77 38.2,61.52 38.2,60 36.02,57.81 U2.16
P23  (via drill 0.3)
  Top 0.254: X1.23 3.93,48.18 8.36,48.18 14.07,53.9 14.07,84.89 14.58,85.39 31.6,85.39 33.38,83.62 33.38,63.55 34.39,62.54 v37.44,62.54
  Bottom 0.254: v37.44,62.54 37.44,60.25 36.27,59.08 U2.17
P24  (via drill 0.3)
  Top 0.254: X1.24 3.92,48.69 7.85,48.69 13.56,54.41 13.56,85.65 13.82,85.9 32.11,85.9 33.88,84.12 33.88,63.8 34.39,63.3 v36.42,63.3
  Bottom 0.254: v36.42,63.3 36.68,63.04 36.68,61.01 36.02,60.35 U2.18
P25  (via drill 0.3)
  Top 0.254: X1.25 3.91,49.2 6.45,49.2 8.1,50.85 9.12,50.85 12.42,54.15 12.42,70.28 12.93,70.79 12.93,73.58 v11.4,75.11
  Bottom 0.254: v11.4,75.11 11.3,75.21 U1.18
P26  (via drill 0.3)
  Top 0.254: X1.26 3.91,49.71 5.94,49.71 6.96,50.72 6.96,51.49 8.74,51.49 11.79,54.53 11.79,70.79 12.17,71.17 12.17,72.19 11.28,73.08 v11.28,73.71
  Bottom 0.254: v11.28,73.71 11.05,73.94 U1.17
P27  (via drill 0.3)
  Top 0.254: X1.27 5.56,50.22 6.2,50.85 6.2,52.12 6.32,52.25 8.61,52.25 11.15,54.79 v11.15,71.68
  Bottom 0.254: v11.15,71.68 10.16,72.67 U1.16
P28  (via drill 0.3)
  Top 0.254: X1.28 1.75,50.72 0.99,51.49 0.99,54.03 1.5,54.53 1.5,66.22 v6.45,71.17
  Bottom 0.254: v6.45,71.17 6.68,71.4 U1.15
P29  (via drill 0.3)
  Top 0.254: X1.29 2.13,51.23 1.5,51.87 1.5,53.9 2.01,54.41 2.01,65.71 v4.42,68.12
  Bottom 0.254: v4.42,68.12 6.43,70.13 U1.14
P30  (via drill 0.3)
  Top 0.254: X1.30 3.87,51.74 2.51,51.74 2.13,52.12 2.13,53.65 2.64,54.15 2.64,65.08 6.2,68.63 v6.45,68.63
  Bottom 0.254: v6.45,68.63 6.68,68.86 U1.13
P31  (via drill 0.3)
  Top 0.254: X1.31 3.87,52.25 2.9,52.25 2.64,52.5 2.64,53.39 3.15,53.9 3.15,64.06 v3.91,64.82
  Bottom 0.254: v3.91,64.82 6.68,67.59 U1.12
P32  (via drill 0.3)
  Top 0.254: X1.32 3.66,52.96 3.66,63.3 v5.44,65.08
  Bottom 0.254: v5.44,65.08 6.68,66.32 U1.11
P33  (via drill 0.3)
  Top 0.254: v89.38,57.84 89.38,53.11 X2.1
  Bottom 0.254: U5.11 86.33,73.97 88.49,71.81 88.49,58.73 v89.38,57.84
P34  (via drill 0.3)
  Top 0.254: v87.73,58.09 87.73,57.2 88.11,56.82 88.11,52.76 88.49,52.38 88.62,52.38 88.75,52.25 89.68,52.25 X2.2
  Bottom 0.254: U5.12 86.46,72.7 87.86,71.3 87.86,58.22 v87.73,58.09
P35  (via drill 0.3)
  Top 0.254: v84.18,59.11 84.18,53.26 85.06,52.38 86.33,52.38 86.97,51.74 89.67,51.74 X2.3
  Bottom 0.254: U5.13 86.33,71.42 87.35,70.41 87.35,62.28 v84.18,59.11
P36  (via drill 0.3)
  Top 0.254: v85.83,51.61 86.21,51.23 89.66,51.23 X2.4
  Bottom 0.254: U5.14 84.68,70.16 83.29,68.76 83.29,67.87 79.86,64.44 79.86,54.91 78.08,53.14 78.08,50.22 80.37,47.93 82.78,47.93 86.08,51.23 86.08,51.36 v85.83,51.61
P37  (via drill 0.3)
  Top 0.254: v84.43,51.36 84.99,50.8 89.7,50.8 X2.5
  Bottom 0.254: U5.15 84.43,68.89 83.92,68.38 83.92,67.61 80.49,64.19 80.49,54.28 80.11,54.28 78.71,52.88 78.71,50.34 80.37,48.69 82.78,48.69 84.81,50.72 84.81,50.98 v84.43,51.36
P38  (via drill 0.3)
  Top 0.254: v83.41,50.6 83.67,50.34 88.8,50.34 88.85,50.29 X2.6
  Bottom 0.254: U5.16 84.68,67.61 83.92,66.85 83.92,66.73 81.13,63.93 81.13,53.65 80.37,53.65 79.48,52.76 79.48,52.5 79.22,52.25 79.22,50.6 80.37,49.45 82.27,49.45 v83.41,50.6
P39  (via drill 0.3)
  Top 0.254: v82.14,51.11 82.14,50.47 82.78,49.84 88.6,49.84 88.65,49.78 X2.7 | X2.7
  Bottom 0.254: U5.17 84.3,66.34 81.76,63.8 81.76,53.26 81.13,52.63 80.37,52.63 80.11,52.38 80.11,51.87 79.86,51.61 79.86,50.85 80.37,50.34 81.38,50.34 v82.14,51.11
P40  (via drill 0.3)
  Top 0.254: v80.87,51.49 80.87,50.85 82.4,49.33 88.24,49.33 88.28,49.28 X2.8
  Bottom 0.254: U5.18 83.79,65.08 82.52,63.8 82.52,53.14 v80.87,51.49
P41  (via drill 0.3)
  Top 0.254: X2.9 82.18,48.78 77.19,53.77 77.19,59.36 76.05,60.5 64.87,60.5 v64.62,60.25
  Bottom 0.254: v64.62,60.25 64.62,59.61 63.98,58.98 61.93,58.98 U6.11
P42  (via drill 0.3)
  Top 0.254: X2.10 82.04,48.28 76.56,53.77 76.56,59.23 75.79,60 65.76,60 65.51,59.74 65.51,59.49 v64.24,58.22
  Bottom 0.254: v64.24,58.22 63.47,58.22 62.97,57.71 61.93,57.71 U6.12
P43  (via drill 0.3)
  Top 0.254: X2.11 81.91,47.78 75.92,53.77 75.92,58.85 75.41,59.36 66.4,59.36 65.89,58.85 65.89,57.71 v65.38,57.2
  Bottom 0.254: v65.38,57.2 65.13,57.2 64.49,56.57 61.9,56.57 U6.13
P44  (via drill 0.3)
  Top 0.254: X2.12 81.65,47.28 75.29,53.65 75.29,56.44 74.78,56.95 66.52,56.95 65.13,55.55 64.49,55.55 v64.24,55.3
  Bottom 0.254: v64.24,55.3 61.9,55.3 U6.14
P45  (via drill 0.3)
  Top 0.254: X2.13 81.38,46.78 74.78,53.39 74.78,54.03 74.4,54.41 v66.14,54.41
  Bottom 0.254: v66.14,54.41 64.24,54.41 63.86,54.03 61.9,54.03 U6.15
P46  (via drill 0.3)
  Top 0.254: X2.14 81.12,46.28 75.54,51.87 68.17,51.87 v66.9,53.14
  Bottom 0.254: v66.9,53.14 64.11,53.14 63.73,52.76 61.9,52.76 U6.16
P47  (via drill 0.3)
  Top 0.254: X2.15 80.99,45.78 77.44,49.33 69.44,49.33 67.03,51.74 66.27,51.74 v66.14,51.87
  Bottom 0.254: v66.14,51.87 64.11,51.87 63.6,51.36 61.93,51.36 U6.17
P48  (via drill 0.3)
  Top 0.254: X2.16 80.89,45.28 80.87,45.26 80.75,45.26 79.22,46.79 69.7,46.79 v66.14,50.34
  Bottom 0.254: v66.14,50.34 62.03,50.34 U6.18
P49  (via drill 0.3)
  Top 0.254: X2.17 73.66,44.78 73.13,44.25 62.46,44.25 v55.73,37.52
  Bottom 0.254: 62.31,32.18 U7.11 62.43,32.05 63.6,32.05 63.98,32.44 63.98,33.96 63.35,34.59 56.24,34.59 55.73,35.1 v55.73,37.52
P50  (via drill 0.3)
  Top 0.254: X2.18 75.96,44.28 73.38,41.71 60.81,41.71 57.63,38.53 v57.63,36.5
  Bottom 0.254: v57.63,36.5 62.2,36.5 64.62,34.09 64.62,32.31 63.09,30.79 62.43,30.79 U7.12
P51  (via drill 0.3)
  Top 0.254: X2.19 77.36,43.78 72.11,38.53 65.89,38.53 64.62,37.26 64.62,30.91 v64.24,30.53
  Bottom 0.254: v64.24,30.53 64.24,30.15 63.6,29.51 62.43,29.51 U7.13
P52  (via drill 0.3)
  Top 0.254: X2.20 77.5,43.28 72.24,38.02 66.01,38.02 65.13,37.14 65.13,29.39 v64.24,28.5
  Bottom 0.254: v64.24,28.5 62.48,28.5 U7.14
P53  (via drill 0.3)
  Top 0.254: X2.21 77.76,42.78 72.49,37.52 66.14,37.52 65.63,37.01 65.63,28.5 v64.24,27.1
  Bottom 0.254: v64.24,27.1 62.36,27.1 U7.15
P54  (via drill 0.3)
  Top 0.254: X2.22 77.89,42.28 72.62,37.01 66.4,37.01 66.14,36.75 66.14,27.48 v64.36,25.7
  Bottom 0.254: v64.36,25.7 62.43,25.7 U7.16
P55  (via drill 0.3)
  Top 0.254: X2.23 78.03,41.78 72.75,36.5 67.03,36.5 66.65,36.12 66.65,26.97 65.38,25.7 65.38,25.07 v64.74,24.43
  Bottom 0.254: v64.74,24.43 62.43,24.43 U7.17
P56  (via drill 0.3)
  Top 0.254: X2.24 78.29,41.28 73.76,36.75 73.76,34.72 73.13,34.09 67.67,34.09 67.28,33.71 67.28,25.2 v65.13,23.04
  Bottom 0.254: v65.13,23.04 62.56,23.04 U7.18
P57  (via drill 0.3)
  Top 0.254: X2.25 78.55,40.78 75.03,37.26 75.03,29.39 v75.54,28.88
  Bottom 0.254: v75.54,28.88 81.64,28.88 82.4,28.12 82.4,26.21 84.18,24.43 85.65,24.43 U8.11
P58  (via drill 0.3)
  Top 0.254: X2.26 78.82,40.28 75.79,37.26 75.79,29.77 76.56,29.01 76.56,28.24 76.68,28.12 76.81,28.12 v76.94,27.99
  Bottom 0.254: v76.94,27.99 81.51,27.99 81.89,27.61 81.89,25.83 84.18,23.55 84.94,23.55 85.19,23.29 85.78,23.29 U8.12
P59  (via drill 0.3)
  Top 0.254: X2.27 79.08,39.78 76.43,37.14 76.43,30.15 77.83,28.75 77.83,27.74 v78.46,27.1
  Bottom 0.254: v78.46,27.1 81,27.1 81.38,26.72 81.38,25.58 84.05,22.91 84.05,22.28 84.43,21.89 85.65,21.89 U8.13
P60  (via drill 0.3)
  Top 0.254: X2.28 79.34,39.28 76.94,36.88 76.94,30.4 79.48,27.86 v79.48,25.83
  Bottom 0.254: v79.48,25.83 80.37,25.83 82.65,23.55 82.65,22.53 84.56,20.62 85.65,20.62 U8.14
P61  (via drill 0.3)
  Top 0.254: X2.29 79.6,38.78 77.57,36.75 77.57,30.66 80.37,27.86 80.37,26.72 80.62,26.47 80.62,24.31 v80.87,24.05
  Bottom 0.254: v80.87,24.05 80.87,23.16 84.56,19.48 85.78,19.48 U8.15
P62  (via drill 0.3)
  Top 0.254: X2.30 79.74,38.28 78.21,36.75 78.21,30.79 81.25,27.74 81.25,24.94 81.89,24.31 81.89,22.78 v80.87,21.77
  Bottom 0.254: v80.87,21.77 81.38,21.77 84.81,18.34 85.7,18.34 U8.16
P63  (via drill 0.3)
  Top 0.254: X2.31 79.87,37.78 78.84,36.75 78.84,30.91 82.4,27.36 82.4,19.23 v83.54,18.08
  Bottom 0.254: v83.54,18.08 84.56,17.07 85.7,17.07 U8.17
P64  (via drill 0.3)
  Top 0.254: X2.32 80.26,37.28 79.48,36.5 79.48,31.29 83.67,27.1 83.67,19.61 83.54,19.48 83.54,19.35 84.3,18.59 84.3,17.2 v83.41,16.31
  Bottom 0.254: v83.41,16.31 83.41,15.93 83.92,15.42 85.52,15.42 U8.18

### Text on the board
tPlace: oled_array_v1 / 2017_06_16 / Yasser Khan | A0 | A1 | 53 | 51 | 49 | 47 | 9V GND | 9V GND | 9V GND